# EAGLE design 130806_AriloRX_FINAL_PCB1 (EAGLE 6.1)
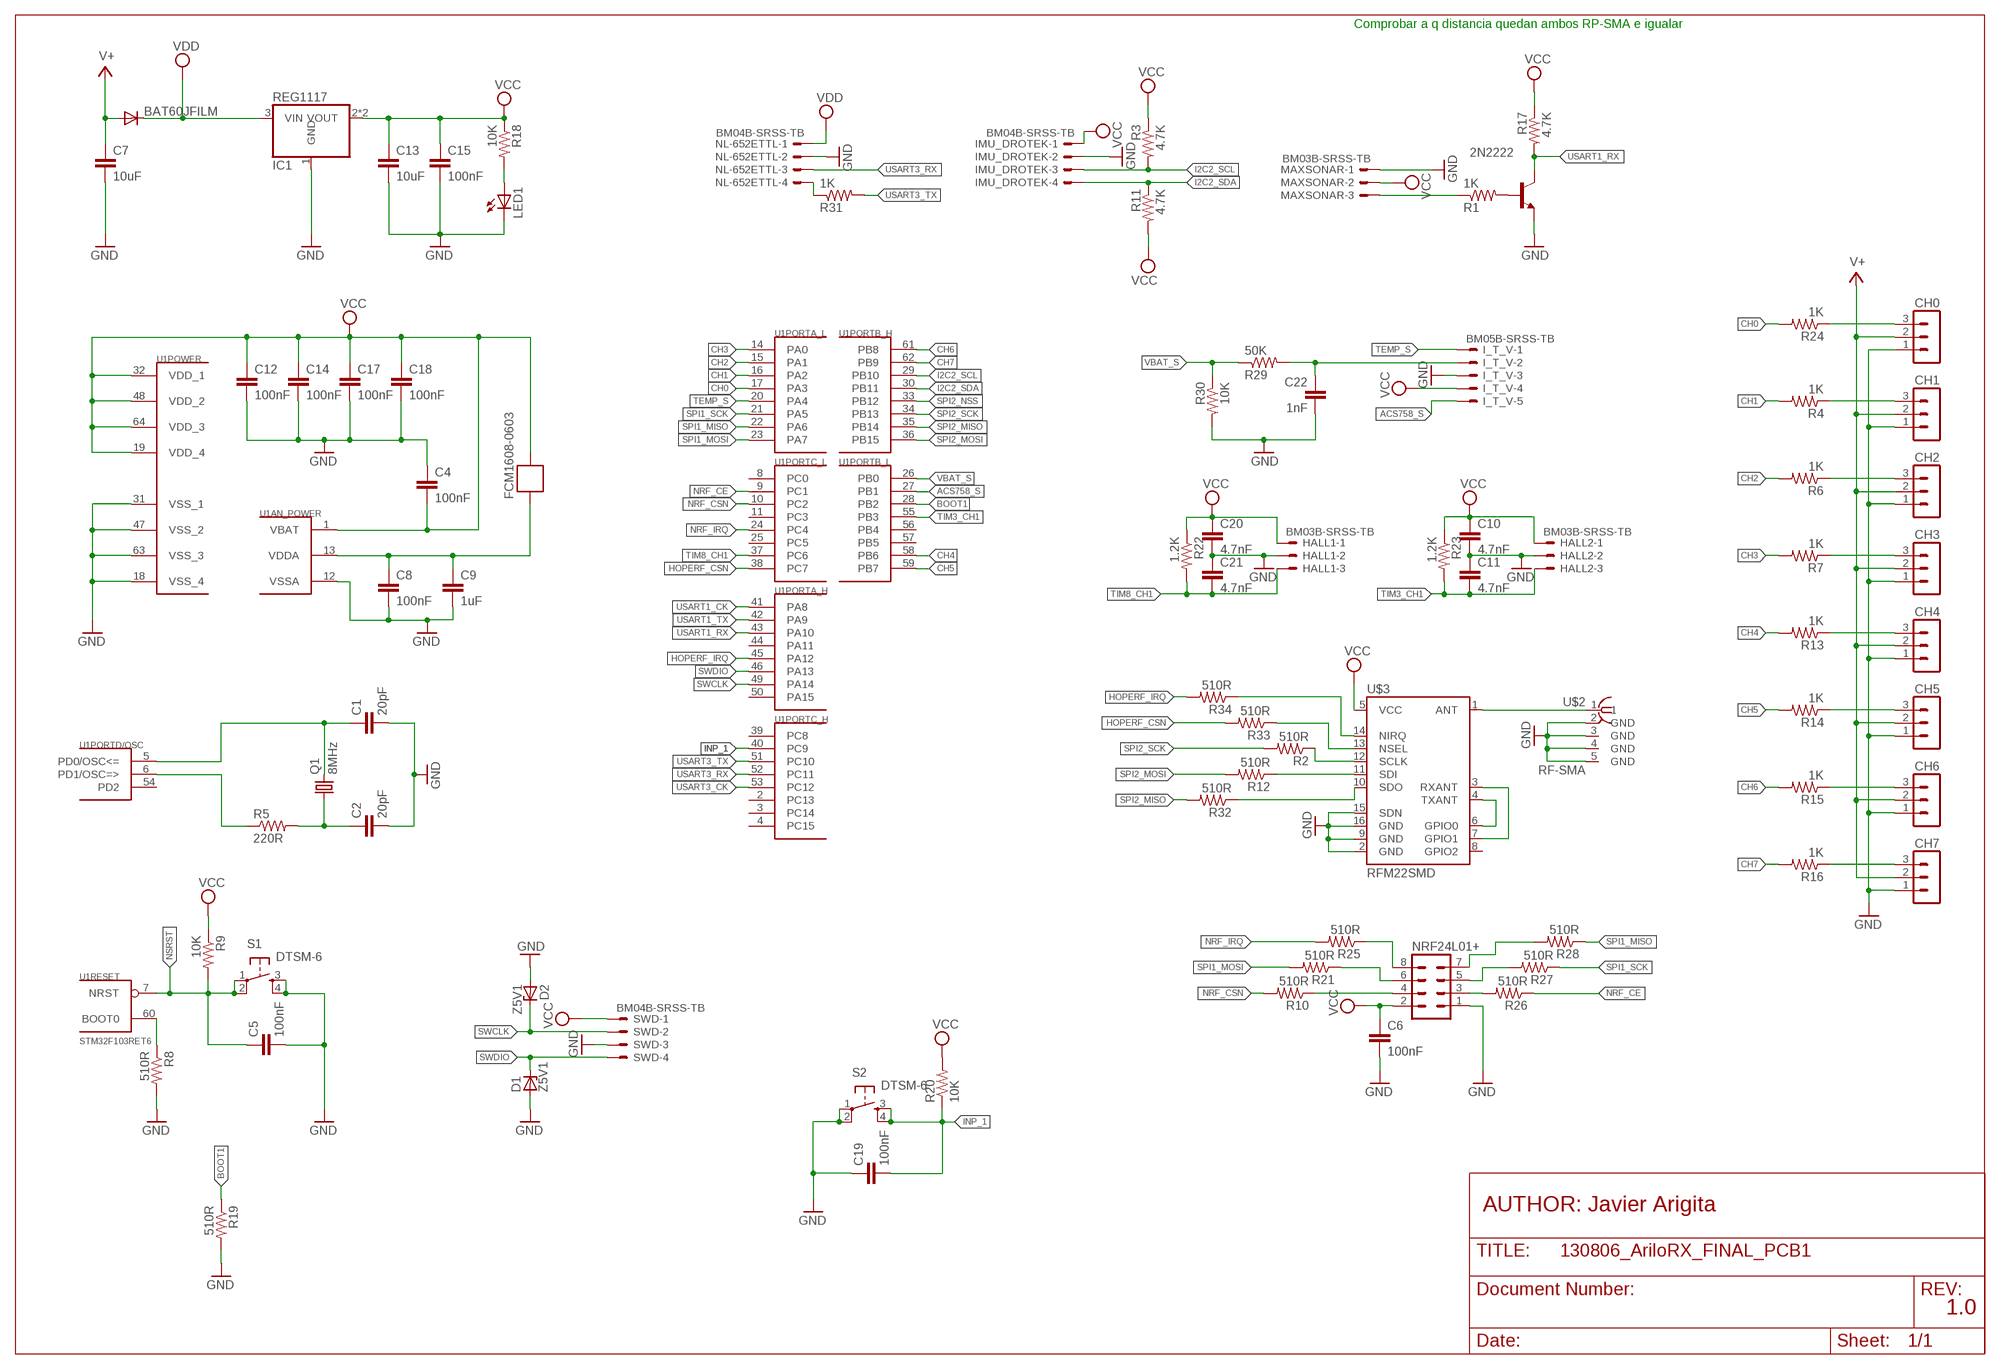
[diagram p0: schematic, sheet 1]

## Parts
2N2222  MMBT2222ALT1-NPN-SOT23-BEC  [SOT23-BEC]
BAT60JFILM  DIODE-SOD323-R  [SOD323-R]
C1  20pF  C-EUC0805  [C0805]
C2  20pF  C-EUC0805  [C0805]
C4  100nF  C-EUC0805  [C0805]
C5  100nF  C-EUC0805  [C0805]
C6  100nF  C-EUC0805  [C0805]
C7  10uF  C-EUC3216  [C3216]
C8  100nF  C-EUC0805  [C0805]
C9  1uF  C-EUC3216  [C3216]
C10  4.7nF  C-EUC0805  [C0805]
C11  4.7nF  C-EUC0805  [C0805]
C12  100nF  C-EUC0805  [C0805]
C13  10uF  C-EUC3216  [C3216]
C14  100nF  C-EUC0805  [C0805]
C15  100nF  C-EUC0805  [C0805]
C17  100nF  C-EUC0805  [C0805]
C18  100nF  C-EUC0805  [C0805]
C19  100nF  C-EUC0805  [C0805]
C20  4.7nF  C-EUC0805  [C0805]
C21  4.7nF  C-EUC0805  [C0805]
C22  1nF  C-EUC0805  [C0805]
CH0  MA03-1  [MA03-1]
CH1  MA03-1  [MA03-1]
CH2  MA03-1  [MA03-1]
CH3  MA03-1  [MA03-1]
CH4  MA03-1  [MA03-1]
CH5  MA03-1  [MA03-1]
CH6  MA03-1  [MA03-1]
CH7  MA03-1  [MA03-1]
D1  Z5V1  ZENER-DIODESOD80C  [SOD80C]
D2  Z5V1  ZENER-DIODESOD80C  [SOD80C]
FCM1608-0603  FERRITE-BEAD  [R0603]
HALL1  BM03B-SRSS-TB  [BM03B-SRSS-TB]
HALL2  BM03B-SRSS-TB  [BM03B-SRSS-TB]
I_T_V  BM05B-SRSS-TB  [BM05B-SRSS-TB]
IC1  REG1117  [SOT223]
IMU_DROTEK  BM04B-SRSS-TB  [BM04B-SRSS-TB]
LED1  LED0805  [CHIPLED_0805]
MAXSONAR  BM03B-SRSS-TB  [BM03B-SRSS-TB]
NL-652ETTL  BM04B-SRSS-TB  [BM04B-SRSS-TB]
NRF24L01+  MA04-2  [MA04-2]
Q1  8MHz  CRYSTALSM49  [SM49]
R1  1K  RESISTOR0805  [R0805]
R2  510R  RESISTOR0805  [R0805]
R3  4.7K  RESISTOR0805  [R0805]
R4  1K  RESISTOR0805  [R0805]
R5  220R  RESISTOR0805  [R0805]
R6  1K  RESISTOR0805  [R0805]
R7  1K  RESISTOR0805  [R0805]
R8  510R  RESISTOR0805  [R0805]
R9  10K  RESISTOR0805  [R0805]
R10  510R  RESISTOR0805  [R0805]
R11  4.7K  RESISTOR0805  [R0805]
R12  510R  RESISTOR0805  [R0805]
R13  1K  RESISTOR0805  [R0805]
R14  1K  RESISTOR0805  [R0805]
R15  1K  RESISTOR0805  [R0805]
R16  1K  RESISTOR0805  [R0805]
R17  4.7K  RESISTOR0805  [R0805]
R18  10K  RESISTOR0805  [R0805]
R19  510R  RESISTOR0805  [R0805]
R20  10K  RESISTOR0805  [R0805]
R21  510R  RESISTOR0805  [R0805]
R22  1.2K  RESISTOR0805  [R0805]
R23  1.2K  RESISTOR0805  [R0805]
R24  1K  RESISTOR0805  [R0805]
R25  510R  RESISTOR0805  [R0805]
R26  510R  RESISTOR0805  [R0805]
R27  510R  RESISTOR0805  [R0805]
R28  510R  RESISTOR0805  [R0805]
R29  50K  RESISTOR0805  [R0805]
R30  10K  RESISTOR0805  [R0805]
R31  1K  RESISTOR0805  [R0805]
R32  510R  RESISTOR0805  [R0805]
R33  510R  RESISTOR0805  [R0805]
R34  510R  RESISTOR0805  [R0805]
S1  DTSM-6  [DTSM-6]
S2  DTSM-6  [DTSM-6]
SWD  BM04B-SRSS-TB  [BM04B-SRSS-TB]
U1  STM32F103RET6  STM32F10XRXT6  [TQFP64]
U$2  RF-SMA  [BU-SMA-H]
U$3  RFM22SMD  [RFM22-XXX-S2]

## Nets
ACS758_S: I_T_V.5 U1.27(PORTB_L:PB1)
BOOT1: R19.1 U1.28(PORTB_L:PB2)
CH0: R24.2 U1.17(PORTA_L:PA3)
CH1: R4.2 U1.16(PORTA_L:PA2)
CH2: R6.2 U1.15(PORTA_L:PA1)
CH3: R7.2 U1.14(PORTA_L:PA0)
CH4: R13.2 U1.58(PORTB_L:PB6)
CH5: R14.2 U1.59(PORTB_L:PB7)
CH6: R15.2 U1.61(PORTB_H:PB8)
CH7: R16.2 U1.62(PORTB_H:PB9)
GND: 2N2222.E C1.2 C2.2 C4.1 C5.2 C6.2 C7.2 C8.2 C9.2 C10.2 C11.1 C12.2 C13.2 C14.2 C15.2 C17.2 C18.2 C19.1 C20.2 C21.1 C22.2 CH0.1 CH1.1 CH2.1 CH3.1 CH4.1 CH5.1 CH6.1 CH7.1 D1.A D2.A HALL1.2 HALL2.2 I_T_V.3 IC1.1(GND) IMU_DROTEK.2 LED1.C MAXSONAR.1 NL-652ETTL.2 NRF24L01+.1 R8.2 R19.2 R30.2 S1.3 S1.4 S2.1 S2.2 SWD.3 U1.12(AN_POWER:VSSA) U1.18(POWER:VSS_4) U1.31(POWER:VSS_1) U1.47(POWER:VSS_2) U1.63(POWER:VSS_3) U$2.2(GND) U$2.3(GND) U$2.4(GND) U$2.5(GND) U$3.2(GND) U$3.9(GND) U$3.15(SDN) U$3.16(GND)
HOPERF_CSN: R33.2 U1.38(PORTC_L:PC7)
HOPERF_IRQ: R34.2 U1.45(PORTA_H:PA12)
I2C2_SCL: IMU_DROTEK.3 R3.2 U1.29(PORTB_H:PB10)
I2C2_SDA: IMU_DROTEK.4 R11.1 U1.30(PORTB_H:PB11)
INP_1: C19.2 R20.1 S2.3 S2.4 U1.40(PORTC_H:PC9)
N$1: C1.1 Q1.2 U1.5(PORTD/OSC:PD0/OSC<=)
N$2: R5.1 U1.6(PORTD/OSC:PD1/OSC=>)
N$3: C2.1 Q1.1 R5.2
N$4: R8.1 U1.60(RESET:BOOT0)
N$5: U$3.3(RXANT) U$3.7(GPIO1)
N$6: U$3.4(TXANT) U$3.6(GPIO0)
N$7: R2.1 U$3.12(SCLK)
N$8: R12.1 U$3.11(SDI)
N$9: CH0.3 R24.1
N$10: LED1.A R18.2
N$11: NL-652ETTL.4 R31.1
N$12: R32.1 U$3.10(SDO)
N$14: MAXSONAR.3 R1.1
N$15: C22.1 I_T_V.2 R29.2
N$16: 2N2222.B R1.2
N$17: C8.1 C9.1 FCM1608-0603.2 U1.13(AN_POWER:VDDA)
N$18: NRF24L01+.4 R10.1
N$19: NRF24L01+.3 R26.2
N$20: U$2.1 U$3.1(ANT)
N$21: CH2.3 R6.1
N$22: R34.1 U$3.14(NIRQ)
N$23: CH4.3 R13.1
N$24: R33.1 U$3.13(NSEL)
N$31: CH3.3 R7.1
N$32: CH6.3 R15.1
N$34: CH5.3 R14.1
N$35: CH7.3 R16.1
N$36: NRF24L01+.5 R27.2
N$38: NRF24L01+.6 R21.1
N$39: NRF24L01+.8 R25.1
N$42: NRF24L01+.7 R28.2
N$53: CH1.3 R4.1
NRF_CE: R26.1 U1.9(PORTC_L:PC1)
NRF_CSN: R10.2 U1.10(PORTC_L:PC2)
NRF_IRQ: R25.2 U1.24(PORTC_L:PC4)
NSRST: C5.1 R9.2 S1.1 S1.2 U1.7(RESET:NRST)
SPI1_MISO: R28.1 U1.22(PORTA_L:PA6)
SPI1_MOSI: R21.2 U1.23(PORTA_L:PA7)
SPI1_SCK: R27.1 U1.21(PORTA_L:PA5)
SPI2_MISO: R32.2 U1.35(PORTB_H:PB14)
SPI2_MOSI: R12.2 U1.36(PORTB_H:PB15)
SPI2_NSS: U1.33(PORTB_H:PB12)
SPI2_SCK: R2.2 U1.34(PORTB_H:PB13)
SWCLK: D2.C SWD.2 U1.49(PORTA_H:PA14)
SWDIO: D1.C SWD.4 U1.46(PORTA_H:PA13)
TEMP_S: I_T_V.1 U1.20(PORTA_L:PA4)
TIM3_CH1: C11.2 HALL2.3 R23.2 U1.55(PORTB_L:PB3)
TIM8_CH1: C21.2 HALL1.3 R22.2 U1.37(PORTC_L:PC6)
USART1_CK: U1.41(PORTA_H:PA8)
USART1_RX: 2N2222.C R17.2 U1.43(PORTA_H:PA10)
USART1_TX: U1.42(PORTA_H:PA9)
USART3_CK: U1.53(PORTC_H:PC12)
USART3_RX: NL-652ETTL.3 U1.52(PORTC_H:PC11)
USART3_TX: R31.2 U1.51(PORTC_H:PC10)
V+: BAT60JFILM.A C7.1 CH0.2 CH1.2 CH2.2 CH3.2 CH4.2 CH5.2 CH6.2 CH7.2
VBAT_S: R29.1 R30.1 U1.26(PORTB_L:PB0)
VCC: C4.2 C6.1 C10.1 C12.1 C13.1 C14.1 C15.1 C17.1 C18.1 C20.1 FCM1608-0603.1 HALL1.1 HALL2.1 I_T_V.4 IC1.2(VOUT) IC1.4(VOUT) IMU_DROTEK.1 MAXSONAR.2 NRF24L01+.2 R3.1 R9.1 R11.2 R17.1 R18.1 R20.2 R22.1 R23.1 SWD.1 U1.1(AN_POWER:VBAT) U1.19(POWER:VDD_4) U1.32(POWER:VDD_1) U1.48(POWER:VDD_2) U1.64(POWER:VDD_3) U$3.5(VCC)
VDD: BAT60JFILM.C IC1.3(VIN) NL-652ETTL.1
Unconnected: U1.2(PORTC_H:PC13) U1.3(PORTC_H:PC14) U1.4(PORTC_H:PC15) U1.8(PORTC_L:PC0) U1.11(PORTC_L:PC3) U1.25(PORTC_L:PC5) U1.39(PORTC_H:PC8) U1.44(PORTA_H:PA11) U1.50(PORTA_H:PA15) U1.54(PORTD/OSC:PD2) U1.56(PORTB_L:PB4) U1.57(PORTB_L:PB5) U$3.8(GPIO2)

## Notes on the sheet
- Comprobar a q distancia quedan ambos RP-SMA e igualar
- AUTHOR: Javier Arigita
- 1.0

## Library data of the parts
2N2222 = transistor:*-NPN-: NPN Transistror BF959 corrected 2008.03.06
BAT60JFILM = diode:DIODE-: DIODE
C1 C2 C4-C6 C8 C10-C12 C14 C15 C17-C22 = rcl:C-EU: CAPACITOR, European symbol
C7 C9 C13 = resistor:C-EU: CAPACITOR, European symbol
CH0 CH1-CH7 = con-lstb:MA03-1: PIN HEADER; OC_FARNELL: unknown; OC_NEWARK: unknown
D1 D2 = diode:ZENER-DIODE: Z-Diode
FCM1608-0603 = BaseApp:FERRITE-BEAD
HALL1 HALL2 MAXSONAR = con-jst2:?M03B-SRSS-TB: Disconnectable Crimp style connector, 1.0mm pitch 3 contacts
I_T_V = con-jst2:?M05B-SRSS-TB: Disconnectable Crimp style connector, 1.0mm pitch 5 contacts
IC1 = CEDT:REG1117: 800mA and 1A Low Dropout (LDO) Positive Regulator 1.8V, 2.5V, 2.85V, 3.3V, 5V, and Adj
IMU_DROTEK NL-652ETTL SWD = con-jst2:?M04B-SRSS-TB: Disconnectable Crimp style connector, 1.0mm pitch 4 contacts
LED1 = CEDT:LED
NRF24L01+ = con-lstb:MA04-2: PIN HEADER; OC_FARNELL: unknown; OC_NEWARK: unknown
Q1 = crystal:CRYSTAL: CRYSTAL; OC_FARNELL: unknown; OC_NEWARK: unknown
R1-R34 = CEDT:RESISTOR
S1 S2 = switch-tact:DTSM-6
U1 = stm32:STM32F10XRXT6: STM32F101/103 64pin LQFP
U$2 = BaseApp:RF-SMA
U$3 = SparkFun-RF:RFM22: The RFM22 is a low-power, low cost radio that is capable of operating in the 434MHz and 900MHz open bands. It's frequency is software defined and there are some very good libraries written for it.

## Board
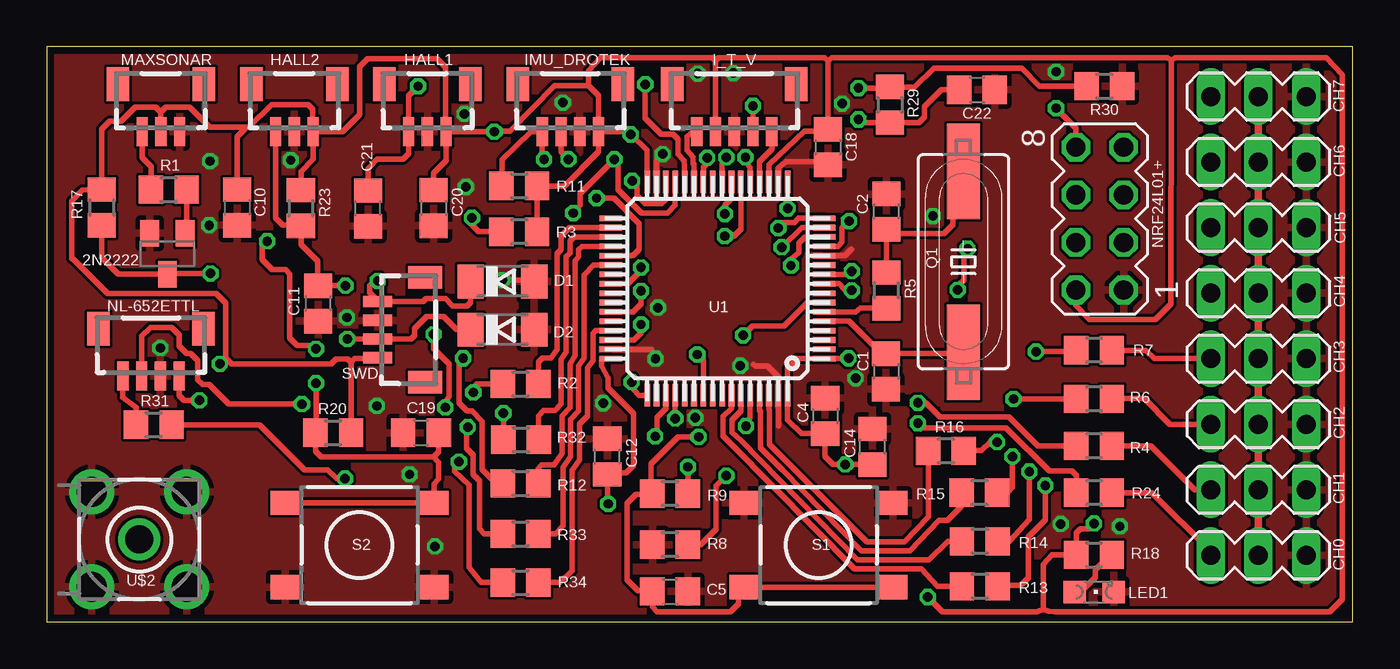
[diagram p1: board, top side]
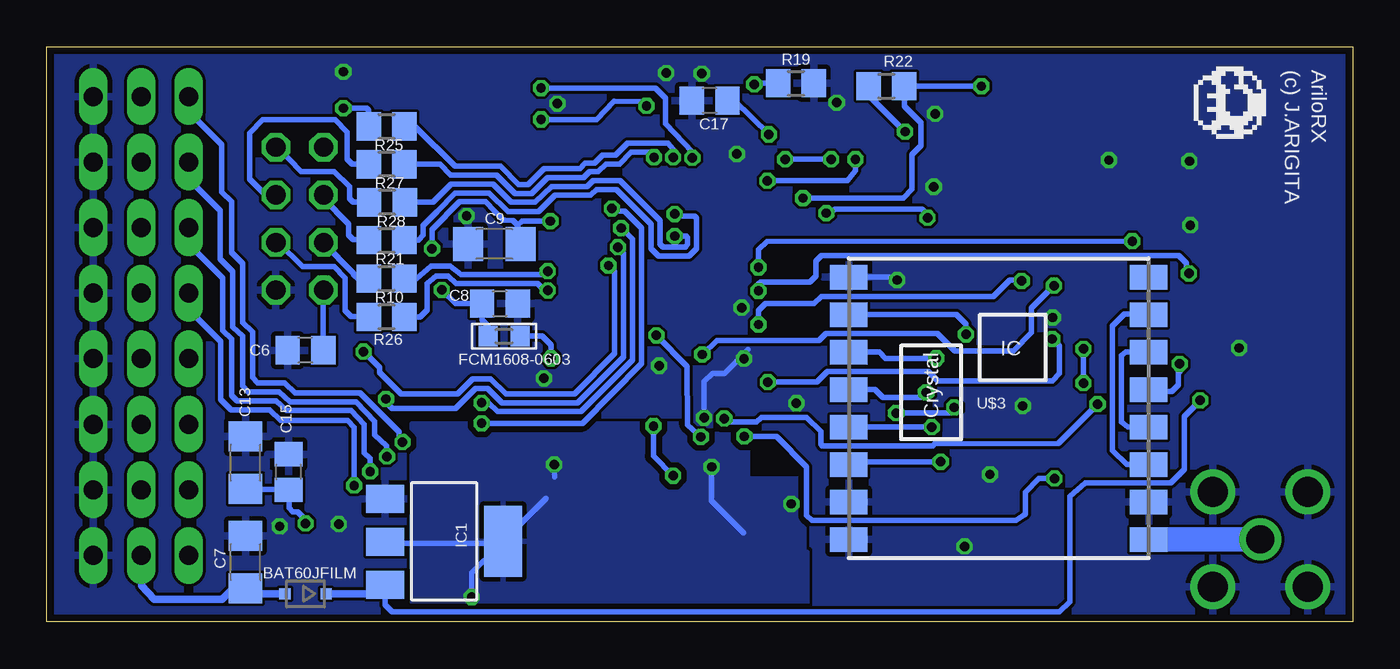
[diagram p2: board, bottom side, seen from below]

Size 69.69 x 30.7 mm. Coordinates in mm from the lower left corner, seen from the top.
Outline: 0,0 69.69,0 69.69,30.7 0,30.7 0,0
Copper layers (1*16): Top 0.0356mm / dielectric 1.5011mm / Bottom 0.0356mm
Design rules: minimum track width 6mil, minimum drill 13mil, track to track 6mil, track to pad 6mil, pad to pad 6mil, via to via 6mil, smd to smd 6mil, copper to edge 15mil, drill to drill 6mil, minimum pad ring 7mil, minimum via ring 7mil, stop-mask expansion 4mil, vias tented up to drill 0mil, thermal gap 10mil

### Footprints (pad centres in the part's own frame; a part is rotated, then mirrored left to right if it is on the bottom)
SOT23-BEC = smd 1 x 1.4: B -0.95,-1.1; C 0,1.1; E 0.95,-1.1
SOD323-R = smd 0.6 x 0.6: A 1.1,0; C -1.1,0
C0805 = smd 1.3 x 1.5: 1 -0.95,0; 2 0.95,0
C3216 = smd 1.6 x 1.8: 1 -1.4,0; 2 1.4,0
MA03-1 = drill 1.016 long: 1 -2.54,0; 2 0,0; 3 2.54,0
SOD80C = smd 1.4 x 1.8: A 1.7,0; C -1.7,0
R0603 = smd 1 x 1.1: 1 -0.85,0; 2 0.85,0
BM03B-SRSS-TB = smd 0.6 x 1.55: 1 1,-1.625; 2 0,-1.625; 3 -1,-1.625 | smd 1.2 x 1.8: FIT@1 2.3,0.9; FIT@2 -2.3,0.9
BM05B-SRSS-TB = smd 0.6 x 1.55: 1 2,-1.625; 2 1,-1.625; 3 0,-1.625; 4 -1,-1.625; 5 -2,-1.625 | smd 1.2 x 1.8: FIT@1 3.3,0.9; FIT@2 -3.3,0.9
SOT223 = smd 1.499 x 2.007: 1 -2.261,-3.15; 2 0.025,-3.15; 3 2.311,-3.15 | smd 3.81 x 2.007: 4 0,3.15
BM04B-SRSS-TB = smd 0.6 x 1.55: 1 1.5,-1.625; 2 0.5,-1.625; 3 -0.5,-1.625; 4 -1.5,-1.625 | smd 1.2 x 1.8: FIT@1 2.8,0.9; FIT@2 -2.8,0.9
CHIPLED_0805 = smd 1.2 x 1.2: A 0,-1.05; C 0,1.05
MA04-2 = drill 1.016 octagon: 1 -3.81,-1.27; 2 -3.81,1.27; 3 -1.27,-1.27; 4 -1.27,1.27; 5 1.27,-1.27; 6 1.27,1.27; 7 3.81,-1.27; 8 3.81,1.27
SM49 = smd 5.08 x 1.778: 1 -4.826,0; 2 4.826,0
R0805 = smd 1.3 x 1.5: 1 -0.95,0; 2 0.95,0
DTSM-6 = smd 1.55 x 1.3: 1 -3.975,2.25; 2 3.975,2.25; 3 -3.975,-2.25; 4 3.975,-2.25
TQFP64 = smd 1.2 x 0.3: 1 -5.7,3.75; 2 -5.7,3.25; 3 -5.7,2.75; 4 -5.7,2.25; 5 -5.7,1.75; 6 -5.7,1.25; 7 -5.7,0.75; 8 -5.7,0.25; 9 -5.7,-0.25; 10 -5.7,-0.75; 11 -5.7,-1.25; 12 -5.7,-1.75; 13 -5.7,-2.25; 14 -5.7,-2.75; 15 -5.7,-3.25; 16 -5.7,-3.75; 33 5.7,-3.75; 34 5.7,-3.25; 35 5.7,-2.75; 36 5.7,-2.25; 37 5.7,-1.75; 38 5.7,-1.25; 39 5.7,-0.75; 40 5.7,-0.25; 41 5.7,0.25; 42 5.7,0.75; 43 5.7,1.25; 44 5.7,1.75; 45 5.7,2.25; 46 5.7,2.75; 47 5.7,3.25; 48 5.7,3.75 | smd 0.3 x 1.2: 17 -3.75,-5.7; 18 -3.25,-5.7; 19 -2.75,-5.7; 20 -2.25,-5.7; 21 -1.75,-5.7; 22 -1.25,-5.7; 23 -0.75,-5.7; 24 -0.25,-5.7; 25 0.25,-5.7; 26 0.75,-5.7; 27 1.25,-5.7; 28 1.75,-5.7; 29 2.25,-5.7; 30 2.75,-5.7; 31 3.25,-5.7; 32 3.75,-5.7; 49 3.75,5.7; 50 3.25,5.7; 51 2.75,5.7; 52 2.25,5.7; 53 1.75,5.7; 54 1.25,5.7; 55 0.75,5.7; 56 0.25,5.7; 57 -0.25,5.7; 58 -0.75,5.7; 59 -1.25,5.7; 60 -1.75,5.7; 61 -2.25,5.7; 62 -2.75,5.7; 63 -3.25,5.7; 64 -3.75,5.7
BU-SMA-H = drill 1.5: 1 0,0 | drill 1.6: 2 -2.54,2.54; 3 2.54,2.54; 4 2.54,-2.54; 5 -2.54,-2.54
RFM22-XXX-S2 = smd 2 x 1.3: 1 -8,7; 2 -8,5; 3 -8,3; 4 -8,1; 5 -8,-1; 6 -8,-3; 7 -8,-5; 8 -8,-7; 9 8,-7; 10 8,-5; 11 8,-3; 12 8,-1; 13 8,1; 14 8,3; 15 8,5; 16 8,7

### Placement (x,y rotation side)
2N2222  6.43,19.65 180 top
BAT60JFILM  55.88,1.5 180 bottom
C1  44.78,13.38 270 top
C2  44.81,21.9 90 top
C4  41.53,11 270 top
C5  33.26,1.62 0 top
C6  55.88,14.5 180 bottom
C7  59.09,3.2 90 bottom
C8  45.51,17 0 bottom
C9  45.81,20.18 180 bottom
C10  10.16,22.12 270 top
C11  14.48,17 90 top
C12  29.91,8.82 90 top
C13  59.09,8.5 90 bottom
C14  44.06,9.35 90 top
C15  56.78,8 90 bottom
C17  34.31,27.82 180 bottom
C18  41.69,25.35 270 top
C19  19.96,10.1 0 top
C20  20.64,22.1 270 top
C21  17.14,22.07 90 top
C22  49.63,28.4 0 top
CH0  64.66,3.55 180 top
CH1  64.66,7.05 180 top
CH2  64.66,10.55 180 top
CH3  64.66,14.05 180 top
CH4  64.66,17.55 180 top
CH5  64.66,21.05 180 top
CH6  64.66,24.55 180 top
CH7  64.66,28.05 180 top
D1  24.31,18.18 0 top
D2  24.31,15.6 0 top
FCM1608-0603  45.28,15.25 180 bottom
HALL1  20.31,27.8 0 top
HALL2  13.21,27.8 0 top
I_T_V  36.69,27.8 0 top
IC1  48.48,4.3 270 bottom
IMU_DROTEK  27.93,27.8 0 top
LED1  55.88,1.6 270 top
MAXSONAR  6.08,27.8 0 top
NL-652ETTL  5.56,14.75 0 top
NRF24L01+  56.19,21.53 90 top
Q1  48.91,19.23 270 top
R1  6.51,23.07 0 top
R2  25.29,12.7 0 top
R3  25.21,20.82 180 top
R4  55.88,9.4 180 top
R5  44.81,17.7 90 top
R6  55.88,11.9 180 top
R7  55.88,14.5 180 top
R8  33.26,4.12 180 top
R9  33.26,6.85 180 top
R10  51.56,18.32 0 bottom
R11  25.21,23.27 0 top
R12  25.29,7.4 0 top
R13  49.78,1.9 180 top
R14  49.78,4.3 180 top
R15  49.76,6.9 180 top
R16  47.98,9.12 180 top
R17  2.94,22.12 270 top
R18  55.88,3.58 0 top
R19  29.71,28.75 0 bottom
R20  15.29,10.1 0 top
R21  51.56,20.38 0 bottom
R22  24.89,28.6 0 bottom
R23  13.56,22.1 270 top
R24  55.88,6.9 180 top
R25  51.56,26.45 0 bottom
R26  51.56,16.27 180 bottom
R27  51.56,24.43 180 bottom
R28  51.53,22.4 180 bottom
R29  44.98,27.6 270 top
R30  56.44,28.6 0 top
R31  5.71,10.53 0 top
R32  25.31,9.72 0 top
R33  25.29,4.7 0 top
R34  25.29,2.1 0 top
S1  41.19,4.1 180 top
S2  16.68,4.1 180 top
SWD  19.29,15.6 270 top
U1  35.78,17.8 180 top
U$2  4.93,4.4 180 top
U$3  18.89,11.4 180 bottom

### Tracks (layer width: path | path; a pad name or v marks a point on that pad's centre or on a via)
ACS758_S
  Top 0.305: I_T_V.5 34.48,26.18 34.16,25.9 34.16,25.18 34.48,24.8 34.48,24.48 34.53,24.43 U1.27
BOOT1  (via drill 0.5)
  Top 0.305: v31.93,28.7 31.93,26.9 32.78,26.05 33.41,26.05 33.69,25.77 33.69,24.98 34.01,24.62 34.03,24.35 U1.28
  Bottom 0.305: R19.1 31.86,28.75 v31.93,28.7
CH0  (via drill 0.5 pad 0.25)
  Top 0.305: R24.2 54.94,7.83 54.71,8.05 53.51,8.05 51.19,10.35 46.76,10.35 v46.48,10.6 | v39.53,22.07 U1.17 39.53,23.57
  Bottom 0.305: v46.48,10.6 41.11,10.6 37.96,13.8 37.96,21.02 38.86,21.93 39.34,21.93 v39.53,22.07
CH1  (via drill 0.5 pad 0.25)
  Top 0.305: R4.2 52.88,9.4 51.34,10.95 47.66,10.95 46.91,11.7 v46.48,11.7 | v39.03,21.02 39.03,21.07 39.28,21.32 39.88,21.32 40.11,21.55 U1.16
  Bottom 0.305: v46.48,11.7 46.11,11.7 45.63,11.22 41.19,11.22 38.44,13.97 38.44,20.43 v39.03,21.02
CH2  (via drill 0.5 pad 0.25)
  Top 0.305: R6.2 v51.59,11.9 | v39.21,20 39.23,20 40.28,21.05 U1.15
  Bottom 0.305: v51.59,11.9 51.59,11.72 51.26,11.4 47.86,11.4 46.81,12.45 46.16,12.45 45.38,11.7 41.36,11.7 38.91,14.15 38.91,19.7 v39.21,20
CH3  (via drill 0.5, 0.5 pad 0.25)
  Top 0.305: U1.14 40.46,20.55 40.13,20.23 40.13,19.73 39.71,19.38 v39.71,19.02 | v52.78,14.43 54.88,14.43 54.98,14.53 54.96,14.53 R7.2
  Bottom 0.305: v39.71,19.02 39.38,18.7 39.38,14.32 41.53,12.18 45.19,12.18 46.01,12.97 46.96,12.97 47.76,12.18 50.78,12.18 51.94,13.32 51.94,13.57 v52.78,14.43
CH4
  Top 0.305: R13.2 47.53,1.9 46.66,2.83 43.11,2.83 36.53,9.47 36.09,9.93 36.09,10.97 36.53,11.4 U1.58
CH5
  Top 0.305: R14.2 48.09,4.3 47.09,3.33 43.26,3.33 37.03,9.68 36.56,10.12 36.56,10.78 37.03,11.25 U1.59 37.03,12.15
CH6
  Top 0.305: R15.2 48.81,6.17 48.06,5.42 47.61,5.42 46.06,3.8 43.46,3.8 39.26,8.12 38.09,9.3 38.09,11.22 38.03,11.28 U1.61
CH7
  Top 0.305: U1.62 38.53,11.35 38.56,11.3 38.56,9.47 43.76,4.28 45.76,4.28 47.03,5.6 R16.2 47.03,9.18
GND  (via drill 0.5, 0.5 pad 0.25)
  Top 0.305: 37.71,13.75 37.81,13.65 38.46,13.65 39.03,13.07 U1.63 39.03,10.45 | U1.12 42.59,19.55 42.94,19.9 | 41.76,24.57 39.44,24.57 39.03,24.23 U1.18 | U1.47 32.26,14.55 | U1.31 32.53,24.65 32.88,25 | v24.31,18.25 25.96,18.25 26.04,18.18
  Bottom 0.305: v34.61,10.9 34.61,12.82 34.16,13.28 33.53,13.28 32.26,14.55 | U$3.9 24.46,18.4 v24.31,18.25
  other vias: 43.16,13 47.28,21.68 34.73,29.27 54.11,5.22 36.63,29.3 37.01,13.68 32.61,16.77 13.01,24.65 22.29,27.12 53.86,29.38 42.44,27.68 57.26,5.1 22.36,23.23 16.01,16.25 17.61,11.53 27.54,27.73 32.86,24.98 32.48,14.05 6.06,14.62 8.71,24.6 29.68,11.68 19.36,7.88 20.71,4.03 8.66,21.18
  pour Bottom (rank 2): 0.48,30.2 69.19,30.2 69.19,0.5 0.48,0.5
  pour Top: 0.48,30.2 69.19,30.2 69.19,0.5 0.48,0.5
HOPERF_CSN
  Top 0.305: U1.38 29.18,19.05 28.66,18.52 28.66,14.1 28.39,13.68 28.39,11.25 27.96,10.8 27.96,8.82 27.56,8.25 27.56,5.12 27.14,4.7 26.29,4.7 | 26.29,4.7 26.26,4.72 | 26.29,4.7 R33.2
HOPERF_IRQ
  Top 0.305: U1.45 29.31,15.55 29.29,15.53 29.26,15.53 29.14,15.4 29.14,13.95 28.86,13.55 28.86,11 28.43,10.57 28.43,8.65 28.04,8.07 28.04,2.73 27.39,2.1 R34.2
I2C2_SCL  (via drill 0.5)
  Top 0.305: IMU_DROTEK.3 27.43,25.1 v27.84,24.7 | U1.29 33.53,22.25 33.11,21.82 31.73,21.82 30.48,23.07 30.48,24.5 v30.29,24.7 28.46,22.88 28.46,22.25 28.29,22.05 v28.09,21.82 | R3.2 23.04,20.82 22.68,21.18 v22.68,21.57
  Bottom 0.305: v27.84,24.7 v30.29,24.7 | v22.68,21.57 22.68,21.75 22.98,22.05 27.64,22.05 27.86,21.82 v28.09,21.82
I2C2_SDA  (via drill 0.5)
  Top 0.305: v26.54,24.7 26.43,24.8 IMU_DROTEK.4 25.84,26.18 24.29,24.68 24.29,23.43 24.26,23.4 R11.1 | v31.23,23.55 31.48,23.32 31.48,22.77 31.91,22.32 32.81,22.32 33.03,22.55 U1.30
  Bottom 0.305: v26.54,24.7 26.54,24.1 26.96,23.55 v31.23,23.55
INP_1  (via drill 0.5)
  Top 0.305: 14.29,10.1 14.31,10.07 14.34,10.07 | R20.1 14.34,10.07 | 14.34,10.07 14.34,9.1 14.63,8.8 20.64,8.8 | 20.64,8.8 20.91,9.07 C19.2 | S2.4 S2.3 20.66,7.38 20.91,7.62 20.91,8.53 20.64,8.8 | U1.40 31.01,18.05 31.71,18.75 v31.71,18.93 | v11.76,20.32 11.48,20.05 11.48,19.35 12.04,18.8 12.73,18.8 12.96,18.57 12.96,15.15 13.36,14.75 14.16,14.75 v14.36,14.57 | v14.36,12.75 14.36,10.1 14.34,10.07
  Bottom 0.305: v31.71,18.93 31.71,19.88 31.26,20.3 v11.76,20.32 | v14.36,14.57 v14.36,12.75
N$1
  Top 0.305: Q1.2 48.31,14.32 C1.1 44.53,14.32 42.81,16.05 U1.5
N$2
  Top 0.305: R5.1 43.41,16.75 43.16,16.55 U1.6
N$3
  Top 0.305: R5.2 C2.1 45.03,20.73 47.88,20.73 48.36,21.2 48.36,22.3 48.88,24.03 Q1.1
N$4  (via drill 0.5)
  Top 0.305: U1.60 37.53,10.9 37.31,10.65 v37.31,10.45 | R8.1 34.88,4.12 35.71,4.95 35.71,7.25 v36.26,7.8
  Bottom 0.305: v37.31,10.45 37.31,8.85 v36.26,7.8
N$5
  Bottom 0.305: U$3.3 12.06,8.4 12.84,9.15 12.84,15.8 12.19,16.43 10.91,16.43 U$3.7
N$6
  Bottom 0.305: U$3.6 12.11,14.4 12.34,14.22 12.34,10.68 12.01,10.4 U$3.4
N$7  (via drill 0.5)
  Top 0.305: R2.1 22.93,12.7 22.76,12.53 v22.76,12.25
  Bottom 0.305: v22.76,12.25 22.79,12.25 23.06,11.97 25.06,11.97 25.48,12.4 U$3.12
N$8  (via drill 0.5)
  Top 0.305: R12.1 23.98,7.4 23.23,8.15 23.23,10.7 22.68,11.25 22.43,11.25 22.01,11.68 22.01,13.88 v22.21,14.07
  Bottom 0.305: v22.21,14.07 24.93,14.07 25.26,14.4 U$3.11
N$9
  Top 0.305: CH0.3 62.12,3.77 58.96,6.9 R24.1
N$10
  Top 0.305: LED1.A 55.19,1.6 55.96,2.38 55.96,2.77 56.76,3.58 R18.2
N$11
  Top 0.305: R31.1 4.76,11.45 4.06,11.97 NL-652ETTL.4
N$12  (via drill 0.5)
  Top 0.305: R32.1 v24.36,11.15 | v21.26,11.45 21.26,11.72 21.46,12.03 21.46,13.78 20.64,14.6 v20.64,15.35
  Bottom 0.305: U$3.10 21.14,16.4 20.64,15.9 v20.64,15.35 | v24.36,11.15 21.51,11.15 v21.26,11.45
N$14
  Top 0.305: R1.1 5.56,24.3 5.08,24.77 MAXSONAR.3 5.08,26.2 5.11,26.23
N$15  (via drill 0.5)
  Top 0.305: C22.1 47.73,28.4 46.84,27.5 46.84,26.95 46.53,26.65 R29.2 43.48,26.65 v43.31,26.82 | v37.69,27.55 I_T_V.2
  Bottom 0.305: v43.31,26.82 40.36,26.82 39.41,27.8 37.91,27.77 v37.69,27.55
N$16
  Top 0.305: R1.2 7.46,20.82 2N2222.B
N$17  (via drill 0.5 pad 0.25)
  Top 0.305: v48.61,17.73 48.61,17.93 48.94,18.25 48.94,19.73 v49.13,19.93 | U1.13 42.21,20.05 42.44,20.27 42.44,21.02 v42.81,21.4
  Bottom 0.305: FCM1608-0603.2 46.13,15.8 46.46,16.12 C8.1 47.88,17 v48.61,17.73 | v49.13,19.93 49.13,20.95 47.66,22.43 46.26,22.43 45.34,21.45 45.26,21.45 44.81,21.43 44.56,21.18 | 44.56,21.18 C9.1 44.26,19.95 44.23,19.93 43.76,19.93 | v42.81,21.4 44.34,21.4 44.56,21.18
N$18
  Bottom 0.305: NRF24L01+.4 54.92,20.21 53.31,18.6 53.31,18.52 53.11,18.32 R10.1 52.48,18.35
N$19
  Bottom 0.305: NRF24L01+.3 57.34,20.26 56.03,18.98 54.36,18.98 53.76,18.35 53.76,16.62 53.44,16.3 52.53,16.3 R26.2
N$20
  Bottom 1.3: U$3.1 U$2.1
N$21
  Top 0.305: CH2.3 59.94,10.55 58.56,11.93 56.86,11.93 R6.1
N$22  (via drill 0.5)
  Top 0.305: R34.1 23.16,2.1 22.54,2.9 22.54,7.33 21.76,8.03 21.76,8.35 v21.98,8.55
  Bottom 0.305: v21.98,8.55 26.73,8.55 U$3.14
N$23  (via drill 0.5 pad 0.25)
  Top 0.152: 50.97,2.54 R13.1
  Top 0.305: R13.1 50.81,1.98 50.84,1.95 51.98,1.95 52.38,2.35 52.38,4.55 53.28,5.45 v53.28,7.28
  Bottom 0.305: CH4.3 62.12,16.68 60.41,14.97 60.41,11.88 59.86,11.32 57.78,11.32 57.21,10.75 53.63,10.75 53.28,10.38 v53.28,7.28
N$24  (via drill 0.5)
  Top 0.305: v22.46,10.4 22.41,10.35 22.41,9.25 22.73,8.93 22.73,7.88 23.09,7.53 23.09,4.97 23.34,4.7 R33.1
  Bottom 0.305: v22.46,10.4 U$3.13
N$31
  Top 0.305: CH3.3 59.11,14.05 58.66,14.5 R7.1
N$32  (via drill 0.5 pad 0.25)
  Top 0.305: v51.53,8.82 51.53,7.17 51.28,6.92 R15.1
  Bottom 0.305: CH6.3 62.12,23.64 60.44,21.95 60.44,19.38 59.76,18.7 59.76,15.75 59.23,15.28 59.23,12.6 58.94,12.28 57.28,12.28 56.71,11.75 53.19,11.75 52.19,10.7 52.19,9.97 51.56,9.4 v51.53,8.82
N$34  (via drill 0.5 pad 0.25)
  Top 0.305: R14.1 51.36,4.3 51.38,4.33 52.44,5.47 v52.44,8.03
  Bottom 0.305: CH5.3 62.12,20.16 60.31,18.35 60.31,15.55 59.81,15.1 59.81,12.1 59.53,11.8 57.46,11.8 56.88,11.28 53.44,11.28 52.76,10.55 52.76,9.03 52.44,8.72 v52.44,8.03
N$35  (via drill 0.5 pad 0.25)
  Top 0.305: v50.71,9.6 50.36,9.6 49.88,9.15 48.96,9.15 | 48.96,9.15 48.94,9.18 | R16.1 48.96,9.15
  Bottom 0.305: CH7.3 62.12,27.23 60.36,25.48 60.36,22.95 59.84,22.43 59.84,19.73 59.23,19.12 59.23,15.97 58.71,15.47 58.71,13.05 58.44,12.75 56.98,12.75 56.44,12.22 52.96,12.22 50.88,10.15 50.88,9.78 v50.71,9.6
N$36
  Bottom 0.305: NRF24L01+.5 58.03,22.8 58.86,23.62 58.86,26.1 58.16,26.8 54.31,26.8 53.66,26.15 53.66,24.7 53.38,24.43 R27.2 52.46,24.43
N$38
  Bottom 0.305: NRF24L01+.6 54.92,22.59 53.59,21.25 53.59,20.65 53.34,20.4 52.53,20.4 | 52.46,20.45 52.51,20.4 52.53,20.4 | R21.1 52.53,20.4 | 52.51,20.43 52.53,20.4
N$39  (via drill 0.5)
  Top 0.305: NRF24L01+.8 54.92,26.36 v53.86,27.43
  Bottom 0.305: 52.48,26.48 R25.1 52.51,27.32 52.61,27.43 v53.86,27.43
N$42
  Bottom 0.305: NRF24L01+.7 57.37,25.34 56.11,24.05 54.36,24.05 53.53,23.25 53.53,22.6 53.34,22.4 R28.2
N$53
  Top 0.305: CH1.3 61.26,7.05 58.91,9.4 R4.1
NRF_CE  (via drill 0.5 pad 0.25)
  Top 0.305: v42.96,17.7 42.61,17.7 42.26,18.05 U1.9
  Bottom 0.305: R26.1 49.76,16.27 49.38,16.65 49.38,18.07 48.91,18.48 48.28,18.48 47.84,18.07 43.51,18.07 43.13,17.7 v42.96,17.7
NRF_CSN  (via drill 0.5 pad 0.25)
  Top 0.305: v42.96,18.73 42.81,18.73 42.63,18.55 U1.10
  Bottom 0.305: R10.2 49.96,18.32 49.19,19 48.16,19 47.59,18.55 43.21,18.55 v42.96,18.73
NRF_IRQ  (via drill 0.5)
  Top 0.305: v36.26,24.8 36.03,24.45 U1.24
  Bottom 0.305: R25.2 50.03,26.45 47.91,24.32 45.48,24.32 44.51,23.35 44.01,23.35 43.16,24.2 41.23,24.2 40.96,24.5 40.46,24.5 40.03,24.93 39.34,24.93 38.71,25.55 36.53,25.55 36.26,25.25 v36.26,24.8
NSRST  (via drill 0.5 pad 0.25)
  Top 0.305: U1.7 40.59,17.05 39.34,15.8 37.66,15.8 v37.16,15.3 | S1.1 S1.2 36.98,1.62 36.96,1.62 36.9,1.69 | v34.78,9.88 33.69,9.88 32.23,8.43 32.23,6.83 | 32.23,6.83 32.21,6.8 31.43,6.8 30.96,6.33 30.96,2.25 31.56,1.65 32.28,1.65 C5.1 32.09,1.62 31.96,1.75 32.16,1.75 32.31,1.6 32.31,0.8 32.56,0.55 36.48,0.55 36.91,0.97 36.9,1.69 | 36.9,1.69 36.96,1.75 | R9.2 32.26,6.85 32.23,6.83
  Bottom 0.305: v34.78,9.88 35.48,10.53 35.51,13.62 v37.16,15.3
SPI1_MISO  (via drill 0.5)
  Top 0.305: v36.19,20.6 36.66,20.6 37.03,20.98 U1.22
  Bottom 0.305: R28.1 49.09,22.4 48.11,23.38 45.88,23.38 44.91,22.4 43.63,22.4 42.76,23.25 40.86,23.25 40.53,23.55 39.09,23.55 36.96,21.43 36.96,20.18 36.81,20 35.61,20 35.48,20.18 35.48,20.52 35.56,20.6 v36.19,20.6
SPI1_MOSI  (via drill 0.5)
  Top 0.305: v36.19,21.77 36.19,22.25 36.53,22.6 U1.23
  Bottom 0.305: R21.2 49.84,20.38 49.61,20.65 49.61,21.15 48.86,21.9 47.91,22.9 46.09,22.9 45.09,21.9 43.44,21.9 42.56,22.77 40.66,22.77 40.36,23.07 39.28,23.07 37.44,21.23 37.44,19.93 37.03,19.52 35.41,19.52 35.01,19.93 35.01,21.55 35.13,21.68 36.09,21.68 v36.19,21.77
SPI1_SCK  (via drill 0.5)
  Top 0.305: v37.28,24.8 37.28,24.62 37.53,24.25 U1.21
  Bottom 0.305: R27.1 48.71,24.43 48.13,23.85 45.69,23.85 44.71,22.88 43.81,22.88 42.96,23.73 41.03,23.73 40.73,24.02 40.26,24.02 39.84,24.45 39.13,24.45 38.51,25.07 37.56,25.07 v37.28,24.8
SPI2_MISO
  Top 0.305: R32.2 26.23,11 26.51,11.28 27.11,11.28 27.43,11.62 27.43,14 27.71,14.4 27.71,19.5 27.91,19.7 27.91,20.32 28.14,20.55 U1.35
SPI2_MOSI
  Top 0.305: R12.2 26.21,7.42 26.21,8.18 26.41,8.38 27.06,8.38 27.48,9 27.48,11 27.91,11.45 27.91,13.78 28.18,14.22 28.18,19.27 28.21,19.3 28.39,19.5 28.39,19.88 28.56,20.05 U1.36
SPI2_SCK
  Top 0.305: R2.2 26.23,13.88 26.46,14.1 26.91,14.1 27.23,14.55 27.23,19.68 27.43,19.88 27.43,20.6 27.89,21.05 U1.34 30.11,21.05
SWCLK  (via drill 0.5)
  Top 0.305: D2.C 21.86,15.6 21.16,16.3 20.26,16.3 19.64,15.68 19.64,15.3 19.43,15.1 SWD.2 v16.04,15.1 | U1.49 31.61,12.1 31.34,12.38 31.34,12.68 v31.21,12.8
  Bottom 0.305: v31.21,12.8 28.59,12.8 28.04,13.38 22.64,13.38 22.14,12.88 16.04,12.88 15.66,13.25 15.66,14.72 v16.04,15.1
SWDIO  (via drill 0.5)
  Top 0.305: D1.C 22.61,17.05 22.43,16.88 21.66,16.88 21.29,17.25 20.23,17.25 20.09,17.1 SWD.4 17.68,17.12 17.23,17.57 17.23,17.95 17.48,18.2 v17.66,18.2 | U1.46 31.34,15.05 31.71,15.43 v31.71,15.88
  Bottom 0.305: v31.71,15.88 31.71,16.62 31.34,17 28.73,17 28.36,17.38 19.16,17.38 18.29,18.25 17.71,18.25 v17.66,18.2
TEMP_S
  Top 0.305: I_T_V.1 38.69,26.07 38.71,26.05 38.71,25.25 38.03,24.57 U1.20
TIM3_CH1  (via drill 0.5)
  Top 0.305: HALL2.3 12.21,21.55 12.59,21.18 13.56,21.18 | 13.56,21.18 13.59,21.15 | U1.55 35.03,13.95 v34.71,14.28 | v15.94,17.95 14.54,17.95 | 14.54,17.95 14.51,17.98 | 14.54,17.95 C11.2 14.46,17.98 14.46,19.25 13.56,20.15 R23.2 13.56,21.18
  Bottom 0.305: v34.71,14.28 34.69,14.28 33.94,15.03 28.48,15.03 28.11,15.4 22.16,15.4 21.23,14.47 18.11,14.47 17.14,15.45 17.14,16.75 v15.94,17.95
TIM8_CH1  (via drill 0.5)
  Top 0.305: C21.2 17.14,24.2 17.64,24.7 19.01,24.7 19.31,25 HALL1.3 | HALL1.3 19.31,26.2 | HALL1.3 19.31,28.1 v19.81,28.6 | v29.34,22.62 30.26,22.62 31.61,21.27 31.61,19.88 31.29,19.55 U1.37
  Bottom 0.305: v19.81,28.6 23.91,28.6 | 23.91,28.6 23.93,28.62 | 23.91,28.6 23.91,27.52 23.04,26.65 23.04,25.43 23.51,24.95 23.51,23.1 23.98,22.62 v29.34,22.62 | R22.2 23.91,28.6
USART1_RX  (via drill 0.5)
  Top 0.305: U1.43 31.29,16.55 31.71,16.98 v31.71,17.68 | R17.2 2.94,19.45 3.81,18.57 6.43,18.57 | 6.43,18.57 6.46,18.6 v8.73,18.6 | 6.43,18.57 2N2222.C
  Bottom 0.305: v31.71,17.68 31.71,18.05 31.61,18.15 28.96,18.15 28.64,18.48 28.64,19.25 28.36,19.55 9.29,19.55 8.88,19.15 8.88,18.73 v8.73,18.6
USART3_RX  (via drill 0.5)
  Top 0.305: U1.52 v33.53,10.85 | v13.61,11.62 9.71,11.62 8.66,12.68 8.31,12.68 8.06,12.93 8.06,13.95 7.68,14.32 7.46,14.32 7.06,14.72 7.06,15.32 6.66,15.72 5.54,15.72 5.06,15.25 NL-652ETTL.3
  Bottom 0.305: v33.53,10.85 33.51,10.85 33.28,10.68 31.81,10.68 31.56,10.93 29.16,10.93 28.39,10.18 28.39,9.47 28.31,9.4 22.41,9.4 22.31,9.5 15.71,9.53 v13.61,11.62
USART3_TX  (via drill 0.5)
  Top 0.305: U1.51 33.03,11.4 32.56,10.93 32.56,10 v32.46,9.9 | v15.91,7.65 15.46,7.65 14.98,8.12 13.76,8.12 11.36,10.53 R31.2
  Bottom 0.305: v32.46,9.9 30.76,9.9 29.14,8.28 29.14,5.67 28.86,5.42 17.98,5.42 17.51,5.72 17.46,5.78 17.46,6.92 16.73,7.65 v15.91,7.65
V+
  Top 0.406: CH7.2 CH6.2 CH5.2 CH4.2 CH3.2 CH2.2 CH1.2 CH0.2
  Bottom 0.406: CH0.2 64.64,3.52 64.64,1.93 63.96,1.2 60.34,1.2 59.73,1.8 C7.1 58.78,1.5 BAT60JFILM.A
VBAT_S  (via drill 0.5)
  Top 0.305: R30.1 52.96,28.6 52.03,29.55 47.34,29.55 46.31,28.55 R29.1 44.96,28.55 44.91,28.5 v43.31,28.5 | v35.23,24.77 35.23,24.48 35.03,24.27 U1.26 35.03,23.48
  Bottom 0.305: v43.31,28.5 37.21,28.5 36.66,27.95 36.66,26.6 35.23,25.07 v35.23,24.77
VCC  (via drill 0.5, 0.5 pad 0.25)
  Top 0.305: U1.32 32.03,25.18 v31.16,26.02 31.01,26.18 IMU_DROTEK.1 | v23.89,26.18 23.84,26.18 | 21.34,26.18 HALL1.1 21.31,24.62 20.64,23.95 C20.1 20.64,22.95 | 21.34,26.18 23.84,26.18 | 23.84,26.18 23.86,26.2 24.71,26.2 27.09,28.62 28.91,28.62 | 28.91,28.62 29.43,28.1 IMU_DROTEK.1 | IMU_DROTEK.1 29.43,25.1 27.64,23.27 R11.2 R3.1 | HALL2.1 14.21,24.7 13.56,24.05 R23.1 13.59,23.02 | 10.66,26.4 8.69,26.4 7.61,27.48 6.33,27.48 6.08,27.23 | 10.66,26.4 10.76,26.4 11.98,27.62 13.94,27.62 14.19,27.38 14.19,26.2 HALL2.1 | C10.1 10.16,25.9 10.66,26.4 | R20.2 16.23,13.85 | 35.69,29.95 35.51,30.12 29.54,30.12 28.91,29.43 28.91,28.62 | 53.19,0.68 53.19,3.08 53.63,3.58 R18.1 54.94,4.75 55.16,4.97 55.61,4.97 v55.88,5.25 | 53.19,0.68 52.84,0.55 47.78,0.55 v47.01,1.32 | NRF24L01+.2 54.92,16.89 55.63,16.15 59.16,16.15 59.98,16.98 60.01,29.6 60.01,29.98 | U1.19 38.53,24.4 40.44,26.2 41.56,26.2 41.71,26.35 41.71,26.32 C18.1 41.69,29.95 | 41.69,29.95 41.88,30.12 59.78,30.12 60.01,29.98 | 60.01,29.98 60.23,30.12 68.28,30.12 69.14,29.2 69.14,1.2 68.46,0.55 53.78,0.55 53.48,0.57 53.19,0.68 | I_T_V.4 35.69,29.95 | 35.69,29.95 35.84,30.12 41.51,30.12 41.69,29.95 | C14.1 v42.61,8.4 41.96,8.4 41.53,8.82 C4.2 40.26,10.05 39.53,10.78 U1.64 39.53,13.53 40.03,14.05 U1.1 42.76,14.05 v42.78,14.07 | R9.1 v34.21,8.28 | MAXSONAR.2 6.08,27.23 | 6.08,27.23 5.81,27.48 4.71,27.48 3.96,26.73 3.36,26.73 2.94,26.3 R17.1 1.89,23.05 1.33,22.48 1.33,19.4 1.39,19.4 3.26,17.52 9.04,17.52 9.54,17.02 9.54,14.07 | U1.48 29.61,14.05 29.61,13.65 29.96,13.03 29.96,12.47 31.31,11.12 31.31,8.35 30.91,7.95 29.98,7.95 C12.1 29.91,6.33 v29.96,6.3
  Top 0.305: 16.23,13.85 16.43,14.05 17.64,14.05 | 17.64,14.05 17.71,14.12 | 16.23,13.85 16.06,14.03 15.44,14.03 15.16,13.78 9.86,13.78 9.56,14.07 9.54,14.07 | HALL2.1 15.79,26.18 16.68,27.07 16.68,29.65 17.11,30.07 20.84,30.07 21.29,29.62 21.29,26.23 21.34,26.18 | 9.51,14.05 v9.23,13.78 9.54,14.07 | 17.64,14.05 17.64,14.07 SWD.1
  Bottom 0.305: R22.1 25.84,28.12 v23.89,26.18 | v47.01,1.32 47.01,2.62 45.7,3.94 | 45.7,3.94 IC1.4 43.03,6.6 | C6.1 54.94,17.68 54.91,17.7 NRF24L01+.2 | IC1.2 51.71,4.28 51.78,4.2 45.96,4.2 45.7,3.94 | v42.61,8.4 42.59,7.75 | v42.78,14.07 42.78,14.78 43.26,15.25 FCM1608-0603.1 | v55.88,5.25 55.88,5.45 56.31,5.88 56.56,5.88 56.76,6.08 56.76,6.75 | 56.76,6.75 56.76,7.05 56.73,7.08 59.06,7.08 C13.1 | v34.21,8.28 34.21,6.45 32.51,4.75 | C17.1 32.98,27.82 v31.16,26.02 | 10.96,12.3 9.66,12.3 9.31,12.65 9.31,13.3 9.29,13.3 9.11,13.47 9.11,13.65 v9.23,13.78 | 10.96,12.3 11.04,12.38 | 10.96,12.3 10.96,12.32 U$3.5 | C15.1 56.78,6.78 56.76,6.75
  pour Bottom (isolate 0.305): 29.29,7.62 29.29,3.7 29.11,3.7 29.11,0.53 50.19,0.53 50.19,10.57 32.28,10.57 32.28,7.62
VDD  (via drill 0.5)
  Top 0.305: v8.13,11.82 7.33,11.82 7.06,12.1 7.06,13.1 NL-652ETTL.1
  Top 0.406: 7.06,13.1 7.01,13.15
  Bottom 0.305: IC1.3 51.63,0.93 51.26,0.55 15.66,0.55 15.09,1.07 15.09,6.7 14.26,7.42 9.71,7.42 8.98,8.15 8.98,10.97 v8.13,11.82
  Bottom 0.406: IC1.3 52.12,1.5 BAT60JFILM.C

### Text on the board
bPlace: AriloRX | (c) J.ARIGITA